# EAGLE design COM644KIT (EAGLE 5.04)
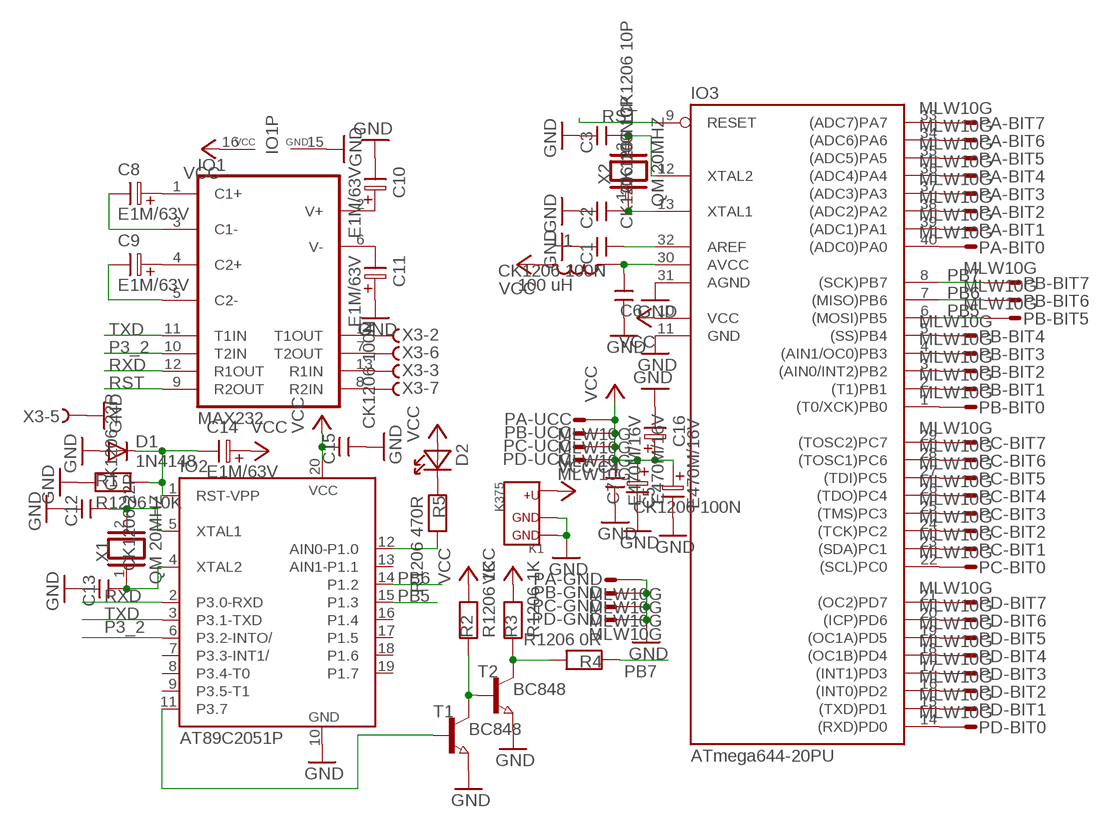
[diagram p0: schematic, sheet 1]

## Parts
C1  CK1206 100N  CK+  [CK+]
C2  CK1206 10P  CK+  [CK+]
C3  CK1206 10P  CK+  [CK+]
C4  CK1206 100N  CK+  [CK+]
C5  E470M/16V  CEL5  [ES-5L]
C6  CK1206 100N  CK+  [CK+]
C7  E470M/16V  CEL5  [ES-5L]
C8  E1M/63V  CEL2,5  [ES-2,5L]
C9  E1M/63V  CEL2,5  [ES-2,5L]
C10  E1M/63V  CEL2,5  [ES-2,5L]
C11  E1M/63V  CEL2,5  [ES-2,5L]
C12  CK1206 22P  CK+  [CK+]
C13  CK1206 22P  CK+  [CK+]
C14  E1M/63V  CEL2,5  [ES-2,5L]
C15  CK1206 100N  CK+  [CK+]
C16  E470M/16V  CEL5  [ES-5L]
D1  1N4148  1N4148DO35-7  [DO35-7]
D2  LED5MM  [LED5]
IO1  MAX232  [DIL16]
IO2  AT89C2051P  [DIL20]
IO3  ATmega644-20PU  MEGA16-P  [DIL40]
K1  K375  K375A  [K375A]
L1  100 uH  L12  [L12]
PA  MLW10G  PSL10MLW10G  [MLW10G]
PB  MLW10G  PSL10MLW10G  [MLW10G]
PC  MLW10G  PSL10MLW10G  [MLW10G]
PD  MLW10G  PSL10MLW10G  [MLW10G]
R1  R1206 10K  RR+  [CK+]
R2  R1206 1K  RR+  [CK+]
R3  R1206 1K  RR+  [CK+]
R4  R1206 0R  RR+  [CK+]
R5  R1206 470R  RR+  [CK+]
T1  BC848  BC848BSOT23  [SOT23]
T2  BC848  BC848BSOT23  [SOT23]
X1  QM 20MHZ  XTAL/S  [QS]
X2  QM 20MHZ  XTAL/S  [QS]
X3  CAN9Z90  [CAN]

## Nets
GND: C1.1 C2.1 C3.1 C4.2 C5.2 C6.1 C7.2 C10.2 C11.1 C12.1 C13.1 C15.2 C16.2 D1.A IO1.15(GND) IO2.10(GND) IO3.11(GND) IO3.31(AGND) K1.1 K1.3 PA.10 PB.10 PC.10 PD.10 R1.1 T1.2(E) T2.2(E) X3.5(-5:F)
N$1: IO3.33((ADC7)PA7) PA.2
N$2: IO3.34((ADC6)PA6) PA.3
N$3: IO3.35((ADC5)PA5) PA.4
N$4: IO3.36((ADC4)PA4) PA.5
N$5: IO3.37((ADC3)PA3) PA.6
N$6: IO3.38((ADC2)PA2) PA.7
N$7: IO3.39((ADC1)PA1) PA.8
N$8: IO3.40((ADC0)PA0) PA.9
N$9: IO2.11(P3.7) T1.1(B)
N$10: R2.1 T1.3(C) T2.1(B)
N$11: R3.1 R4.2 T2.3(C)
N$12: IO3.5((SS)PB4) PB.5
N$13: IO3.4((AIN1/OC0)PB3) PB.6
N$14: IO3.3((AIN0/INT2)PB2) PB.7
N$15: IO3.2((T1)PB1) PB.8
N$16: IO3.1((T0/XCK)PB0) PB.9
N$17: IO3.29((TOSC2)PC7) PC.2
N$18: IO3.28((TOSC1)PC6) PC.3
N$19: IO3.27((TDI)PC5) PC.4
N$20: IO3.26((TDO)PC4) PC.5
N$21: IO3.24((TCK)PC2) PC.7
N$22: IO3.25((TMS)PC3) PC.6
N$23: IO3.23((SDA)PC1) PC.8
N$24: IO3.22((SCL)PC0) PC.9
N$25: IO3.21((OC2)PD7) PD.2
N$26: IO3.20((ICP)PD6) PD.3
N$27: IO3.19((OC1A)PD5) PD.4
N$28: IO3.18((OC1B)PD4) PD.5
N$29: IO3.17((INT1)PD3) PD.6
N$30: IO3.16((INT0)PD2) PD.7
N$31: IO3.15((TXD)PD1) PD.8
N$32: IO3.14((RXD)PD0) PD.9
N$33: C1.2 IO3.32(AREF)
N$34: C3.2 IO3.12(XTAL2) X2.2
N$35: C2.2 IO3.13(XTAL1) X2.1
N$36: C6.2 IO3.30(AVCC) L1.2
N$37: C8.1 IO1.1(C1+)
N$38: C9.1 IO1.4(C2+)
N$39: C10.1 IO1.2(V+)
N$40: C11.2 IO1.6(V-)
N$41: C8.2 IO1.3(C1-)
N$42: C9.2 IO1.5(C2-)
N$43: C12.2 IO2.5(XTAL1) X1.2
N$44: C13.2 IO2.4(XTAL2) X1.1
N$45: C14.2 D1.C IO2.1(RST-VPP) R1.2
N$46: IO1.14(T1OUT) X3.2(-2:F)
N$47: IO1.13(R1IN) X3.3(-3:F)
N$48: IO1.7(T2OUT) X3.6(-6:F)
N$49: IO1.8(R2IN) X3.7(-7:F)
N$50: IO2.12(AIN0-P1.0) R5.2
N$51: D2.2 R5.1
P3_2: IO1.10(T2IN) IO2.6(P3.2-INTO/)
PB5: IO2.15(P1.3) IO3.6((MOSI)PB5) PB.4
PB6: IO2.14(P1.2) IO3.7((MISO)PB6) PB.3
PB7: IO3.8((SCK)PB7) PB.2 R4.1
RST: IO1.9(R2OUT) IO3.9(RESET)
RXD: IO1.12(R1OUT) IO2.2(P3.0-RXD)
TXD: IO1.11(T1IN) IO2.3(P3.1-TXD)
VCC: C4.1 C5.1 C7.1 C14.1 C15.1 C16.1 D2.1 IO1.16(VCC) IO2.20(VCC) IO3.10(VCC) K1.2 L1.1 PA.1 PB.1 PC.1 PD.1 R2.2 R3.2
Unconnected: IO2.7(P3.3-INT1/) IO2.8(P3.4-T0) IO2.9(P3.5-T1) IO2.13(AIN1-P1.1) IO2.16(P1.4) IO2.17(P1.5) IO2.18(P1.6) IO2.19(P1.7) X3.1(-1:F) X3.4(-4:F) X3.8(-8:F) X3.9(-9:F) X3.G1(-G:G1) X3.G2(-G:G2)

## Library data of the parts
C1-C4 C6 C12 C13 C15 = !MOJE:CK+
C5 C7 C16 = !MOJE:CEL5
C8-C11 C14 = !MOJE:CEL2,5
D1 = diode:1N4148: DIODE high speed (Philips)
D2 = !MOJE:LED5MM
IO1 = maxim:MAX232: RS232 TRANSEIVER
IO2 = atmel:AT89C2051: 80C31 MICROCONTROLLER 2 Kbytes FLASH 2.7 V
IO3 = atmel:MEGA16-P: MICROCONTROLLER 16 Kbytes FLASH 1 kbytes SRAM 512 bytes EEPROM USART 8-channel 10 bit ADC Source: avr.lbr
K1 = !MOJE:K375A
L1 = !MOJE:L12
PA PB PC PD = !MOJE:PSL10: CONNECTOR
R1-R5 = !MOJE:RR+
T1 T2 = !MOJE:BC848B: NPN TRANSISTOR
X1 X2 = !MOJE:XTAL/S: CRYSTAL
X3 = !MOJE:CAN9Z90: SUB-D

## Board
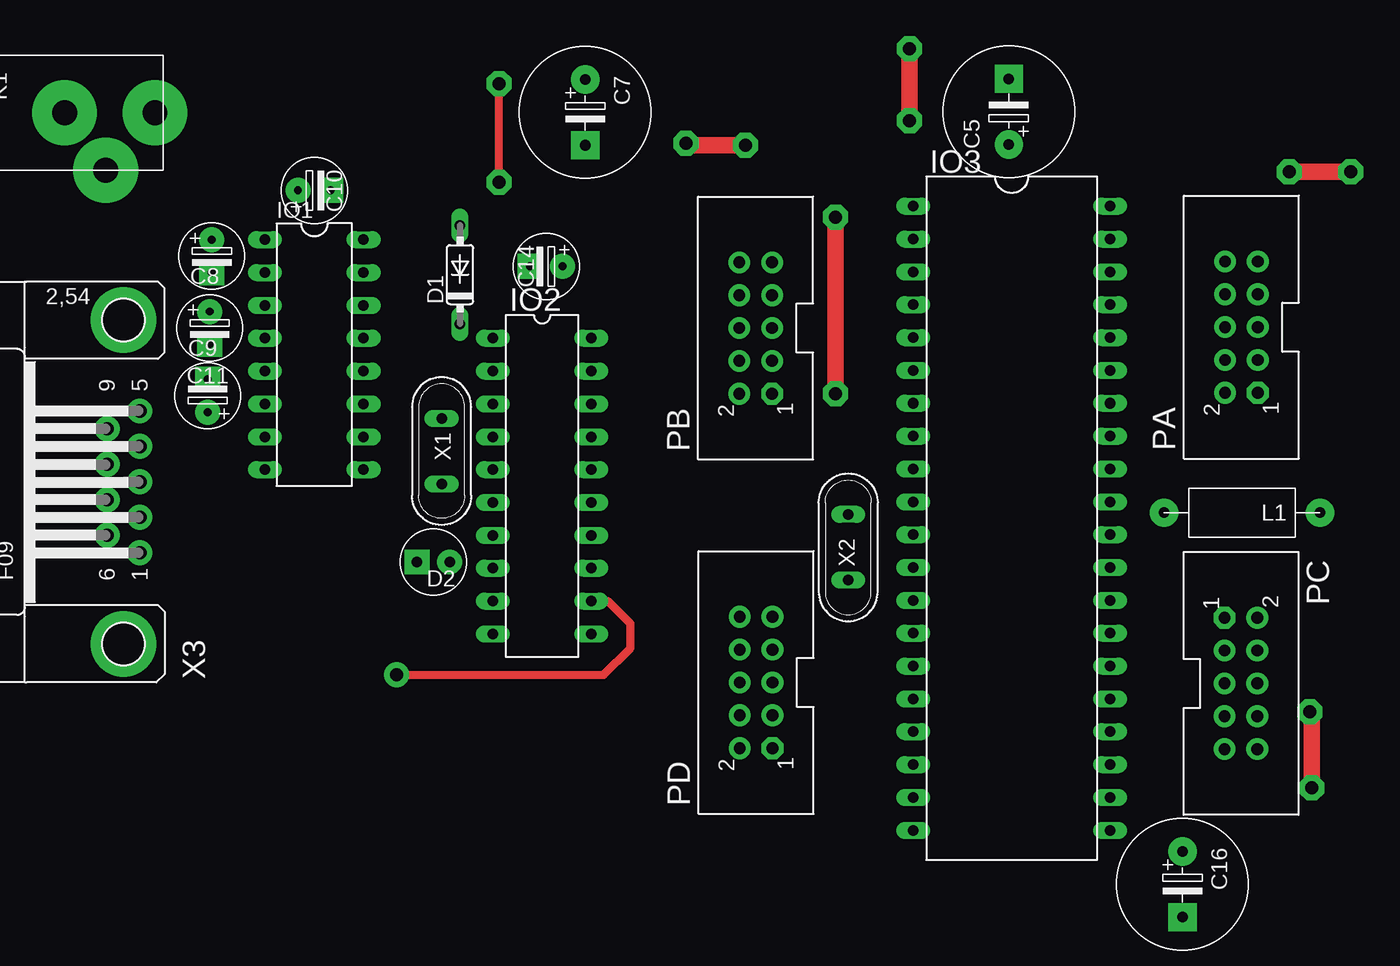
[diagram p1: board, top side]
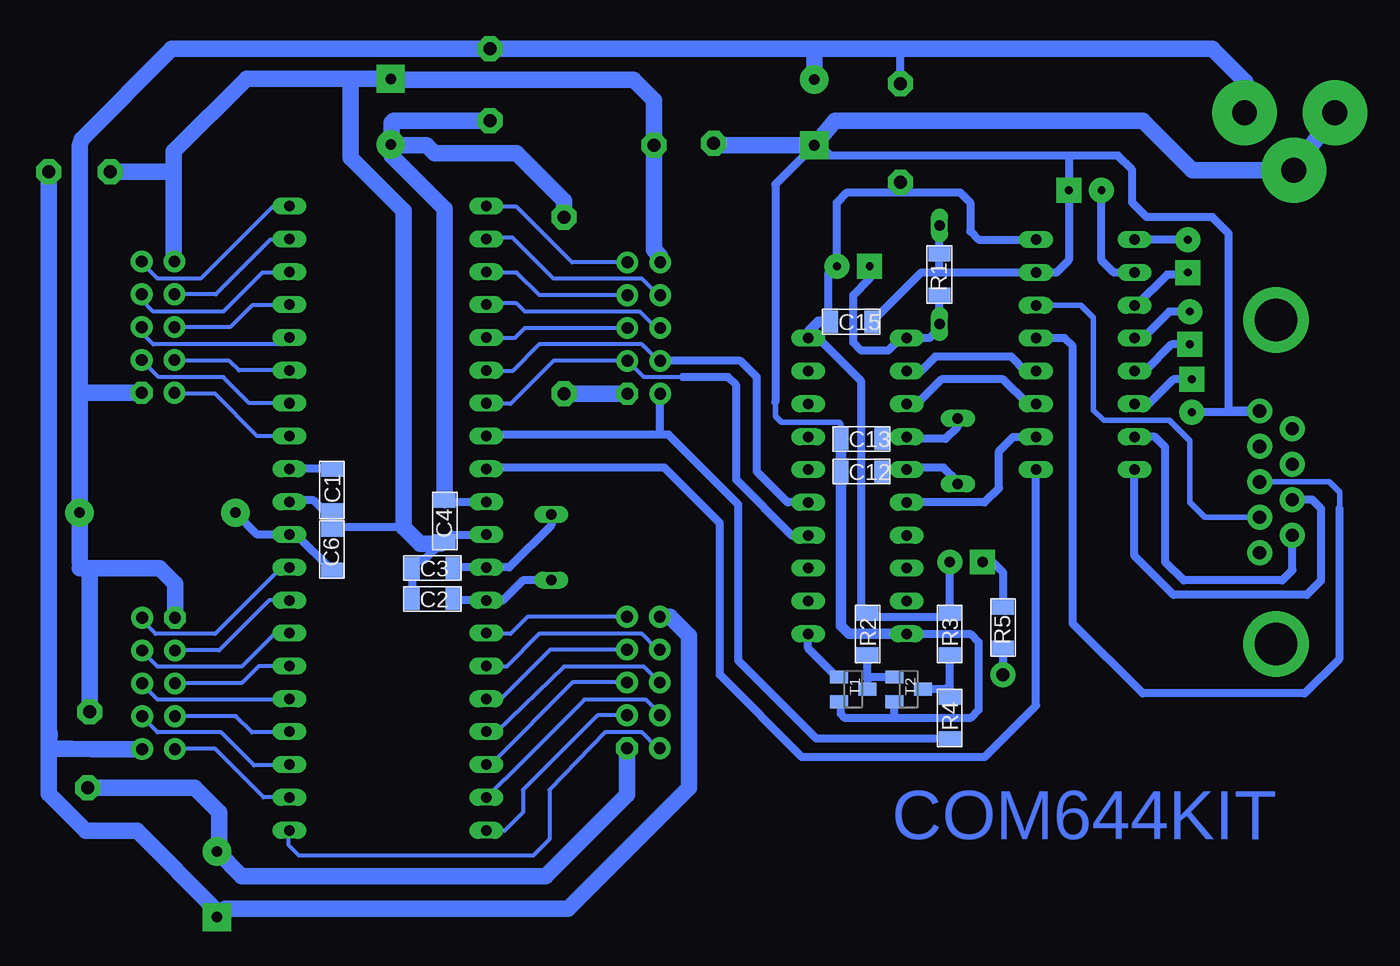
[diagram p2: board, bottom side, seen from below]

No outline drawn. Coordinates in mm, seen from the top.
Copper layers (1*16): Top 0.035mm / dielectric 1.5mm / Bottom 0.035mm
Design rules "default": minimum track width 10mil, minimum drill 24mil, track to track 8mil, track to pad 8mil, pad to pad 8mil, via to via 8mil, smd to smd 8mil, copper to edge 40mil, drill to drill 8mil, minimum pad ring 10mil, minimum via ring 8mil, stop-mask expansion 4mil, vias tented up to drill 0mil, thermal gap 10mil

### Footprints (pad centres in the part's own frame; a part is rotated, then mirrored left to right if it is on the bottom)
CK+ = smd 1.14 x 1.7: 1 -1.587,0; 2 1.587,0
ES-5L = drill 0.813 pad 2.184 round: 1 -2.54,0 | drill 0.813 pad 2.184 square: 2 2.54,0
ES-2,5L = drill 0.61 pad 1.93 round: 1 0,0 | drill 0.61 pad 1.93 square: 2 2.54,0
DO35-7 = drill 0.813 long: A 3.81,0; C -3.81,0
LED5 = drill 0.813 pad 1.93 round: 1 -1.27,0 | drill 0.813 pad 1.93 square: 2 1.27,0
DIL16 = drill 0.813 long: 1 -8.89,-3.81; 2 -6.35,-3.81; 3 -3.81,-3.81; 4 -1.27,-3.81; 5 1.27,-3.81; 6 3.81,-3.81; 7 6.35,-3.81; 8 8.89,-3.81; 9 8.89,3.81; 10 6.35,3.81; 11 3.81,3.81; 12 1.27,3.81; 13 -1.27,3.81; 14 -3.81,3.81; 15 -6.35,3.81; 16 -8.89,3.81
DIL20 = drill 0.813 long: 1 -11.43,-3.81; 2 -8.89,-3.81; 3 -6.35,-3.81; 4 -3.81,-3.81; 5 -1.27,-3.81; 6 1.27,-3.81; 7 3.81,-3.81; 8 6.35,-3.81; 9 8.89,-3.81; 10 11.43,-3.81; 11 11.43,3.81; 12 8.89,3.81; 13 6.35,3.81; 14 3.81,3.81; 15 1.27,3.81; 16 -1.27,3.81; 17 -3.81,3.81; 18 -6.35,3.81; 19 -8.89,3.81; 20 -11.43,3.81
DIL40 = drill 0.813 long: 1 -24.13,-7.62; 2 -21.59,-7.62; 3 -19.05,-7.62; 4 -16.51,-7.62; 5 -13.97,-7.62; 6 -11.43,-7.62; 7 -8.89,-7.62; 8 -6.35,-7.62; 9 -3.81,-7.62; 10 -1.27,-7.62; 11 1.27,-7.62; 12 3.81,-7.62; 13 6.35,-7.62; 14 8.89,-7.62; 15 11.43,-7.62; 16 13.97,-7.62; 17 16.51,-7.62; 18 19.05,-7.62; 19 21.59,-7.62; 20 24.13,-7.62; 21 24.13,7.62; 22 21.59,7.62; 23 19.05,7.62; 24 16.51,7.62; 25 13.97,7.62; 26 11.43,7.62; 27 8.89,7.62; 28 6.35,7.62; 29 3.81,7.62; 30 1.27,7.62; 31 -1.27,7.62; 32 -3.81,7.62; 33 -6.35,7.62; 34 -8.89,7.62; 35 -11.43,7.62; 36 -13.97,7.62; 37 -16.51,7.62; 38 -19.05,7.62; 39 -21.59,7.62; 40 -24.13,7.62
K375A = drill 1.93 pad 5 round: 1 4.445,6.985; 2 4.445,13.97; 3 8.89,10.16
L12 = drill 0.813 pad 2.184 round: 1 0,0; 2 12.065,0
MLW10G = drill 0.914 pad 1.676 octagon: 1 -5.08,-1.27 | drill 0.914 pad 1.676 round: 2 -5.08,1.27; 3 -2.54,-1.27; 4 -2.54,1.27; 5 0,-1.27; 6 0,1.27; 7 2.54,-1.27; 8 2.54,1.27; 9 5.08,-1.27; 10 5.08,1.27
SOT23 = smd 1 x 1.4: 1 -0.95,-1.1; 2 0.95,-1.1; 3 0,1.1
QS = drill 0.813 long: 1 -2.54,0; 2 2.54,0
CAN = drill 1.016 pad 1.93 round: 1 -5.486,-1.27; 2 -2.743,-1.27; 3 0,-1.27; 4 2.743,-1.27; 5 5.486,-1.27; 6 -4.115,1.27; 7 -1.372,1.27; 8 1.372,1.27; 9 4.115,1.27 | drill 3.302 pad 5.08 round: G1 -12.522,0; G2 12.522,0

### Placement (x,y rotation side)
C1  81.6,34.13 90 bottom
C2  73.82,25.72 0 bottom
C3  73.82,28.1 0 bottom
C4  72.87,31.75 270 bottom
C5  77.06,63.39 90 top
C6  81.6,29.53 270 bottom
C7  44.29,63.34 270 top
C8  15.4,53.5 270 top
C9  15.24,47.94 270 top
C10  22.07,57.31 0 top
C11  15.08,40.16 90 top
C12  40.64,35.56 0 bottom
C13  40.64,38.1 0 bottom
C14  42.55,51.43 180 top
C15  41.43,47.15 0 bottom
C16  90.49,3.65 270 top
D1  34.61,50.8 90 top
D2  32.54,28.57 180 top
IO1  23.34,44.61 270 top
IO2  40.96,34.45 270 top
IO3  77.27,31.96 270 top
K1  -2.97,67.76 270 top
L1  101.12,32.38 180 top
PA  95.05,46.74 90 top
PB  57.47,46.66 90 top
PC  95.01,19.19 270 top
PD  57.51,19.26 90 top
R1  34.61,50.8 270 bottom
R2  40.16,23.02 90 bottom
R3  33.81,23.02 90 bottom
R4  33.81,16.51 90 bottom
R5  29.69,23.5 270 bottom
T1  41.27,18.73 270 bottom
T2  36.99,18.73 270 bottom
X1  33.18,37.15 270 top
X2  64.63,29.71 90 top
X3  8.57,34.77 90 top

### Tracks (layer width: path | path; a pad name or v marks a point on that pad's centre or on a via)
GND  (via drill 1 pad 1.93)
  Top 1.27: v56.67,60.8 52.23,60.8 v52.07,60.96 | v98.74,58.74 v103.5,58.74
  Bottom 0.406: C13.1 42.23,39.21 42.39,39.37 46.83,39.37 47.31,39.85 47.31,40.96
  Bottom 0.61: IO3.11 72.34,30.69 C4.2 73.03,30 73.18,30 74.45,28.73 74.77,28.73 C3.1 | C3.1 C2.1 | C3.1 | 76.04,31.27 80.96,31.27 | 80.96,31.27 81.52,31.83 | 81.52,31.83 83.03,33.34 84.79,33.34 IO3.31 | C11.1 9.93,40.16 X3.5 11.99,40.25 12.06,40.32 12.22,40.16 12.22,53.82 12.22,53.98 13.49,55.24 18.57,55.24 19.68,56.36 19.68,58.9 20.8,60.01 | R1.1 D1.A | 34.45,50.96 IO1.15 25.56,50.96 24.61,51.91 C10.2 24.61,60.01 23.5,60.01 20.8,60.01 | 34.45,50.96 34.61,50.96 R1.1 | R1.1 34.61,51.12 34.45,50.96 | 34.45,50.96 36.04,50.96 C15.2 | C1.1 81.6,31.91 81.52,31.83 | 80.96,31.27 81.44,31.27 C6.1 | 20.8,60.01 43.02,60.01 44.13,61.12 44.29,61.12 C7.2 47.31,57.78 47.31,40.96 | 42.23,17.78 T1.2 42.23,17.64 42.23,16.83 41.91,16.51 38.1,16.51 38.09,16.52 | 38.09,16.52 T2.2 | 41.59,23.02 32.23,23.02 31.59,22.38 31.59,17.14 32.23,16.51 38.08,16.51 38.09,16.52
  Bottom 0.813: C13.1 C12.1 | C12.1 | C12.1 42.23,23.65 41.59,23.02 IO2.10 | IO2.10
  Bottom 1.27: 80.17,65.94 C5.2 77,65.88 58.26,65.88 56.67,64.29 v56.67,60.8 56.67,52.7 56.2,52.23 PB.10 | 80.17,65.94 88.21,65.94 93.82,60.33 | 93.82,60.33 | 93.82,60.33 93.82,59.05 | 93.82,59.05 93.82,51.86 PA.10 | 73.18,30 74.77,30 76.04,31.27 76.04,55.72 80.17,59.85 80.17,65.94 | PC.10 100.15,14.11 101.76,14.13 103.5,14.13 | 103.42,15.32 103.5,15.56 v103.5,58.74 | 103.42,15.32 103.5,14.13 | v98.74,58.74 94.14,58.74 93.82,59.05 | v52.07,60.96 51.91,60.8 C7.2 42.7,62.71 18.89,62.71 15.05,58.87 K1.3 4.34,62.84 K1.1 | PD.10 55.45,24.34 53.98,22.86 53.98,11.11 63.34,1.75 89.85,1.75 C16.2 90.49,1.59 96.68,7.78 100.65,7.78 103.5,10.64 103.5,14.13 | 103.5,14.13 103.5,15.4 103.42,15.32
N$1
  Bottom 0.305: IO3.33 87.36,38.31 90.65,41.59 93.71,41.59 PA.2
N$2
  Bottom 0.305: IO3.34 88,40.85 90.01,42.86 94.98,42.86 PA.3
N$3
  Bottom 0.305: IO3.35 88.79,43.39 89.53,44.13 93.71,44.13 PA.4
N$4
  Bottom 0.305: PA.5 96.32,46.31 95.41,45.4 85.42,45.4 IO3.36
N$5
  Bottom 0.305: PA.6 89.47,46.74 87.79,48.42 84.95,48.42 IO3.37
N$6
  Bottom 0.305: PA.7 96.32,48.85 95.41,47.94 90.01,47.94 87,50.96 84.95,50.96 IO3.38
N$7
  Bottom 0.305: PA.8 90.58,49.28 86.36,53.5 84.95,53.5 IO3.39
N$8
  Bottom 0.305: PA.9 96.32,51.71 95.09,50.48 91.76,50.48 86.2,56.04 84.95,56.04 IO3.40
N$9
  Bottom 0.61: T1.1 42.54,19.68 44.77,21.91 IO2.11
N$10
  Bottom 0.61: 40.17,19.53 T1.3 | 40.17,19.53 40.17,21.42 R2.1 | T2.1 40.02,19.68 40.17,19.53
N$11
  Bottom 0.61: 33.81,19.05 R4.2 | 33.81,19.05 R3.1 | T2.3 34.13,18.73 33.81,19.05
N$12
  Bottom 0.305: PB.5 66.68,46.66 67.47,45.88 69.6,45.88 IO3.5
N$13
  Bottom 0.305: PB.6 56.51,46.66 57.78,47.94 66.67,47.94 67.31,48.58 69.55,48.58 IO3.4
N$14
  Bottom 0.305: PB.7 65.56,49.2 67.31,50.96 69.6,50.96 IO3.3
N$15
  Bottom 0.305: PB.8 56.35,49.2 57.63,50.48 64.45,50.48 67.63,53.66 69.55,53.66 IO3.2
N$16
  Bottom 0.305: PB.9 63.02,51.74 67.31,56.04 69.6,56.04 IO3.1
N$17
  Bottom 0.305: PC.2 96.28,24.05 95.25,23.02 90.65,23.02 85.57,28.1 84.95,28.1 IO3.29
N$18
  Bottom 0.305: IO3.28 86.47,25.61 90.33,21.75 93.72,21.75 PC.3
N$19
  Bottom 0.305: PC.4 96.28,21.67 95.09,20.48 88.58,20.48 86.04,23.02 84.95,23.02 IO3.27
N$20
  Bottom 0.305: IO3.26 87.26,20.53 88.58,19.21 93.72,19.21 PC.5
N$21
  Bottom 0.305: PC.7 89.04,16.65 87.79,15.4 84.95,15.4 IO3.24
N$22
  Bottom 0.305: PC.6 96.28,19.13 95.09,17.94 84.95,17.94 IO3.25
N$23
  Bottom 0.305: PC.8 96.28,16.59 95.09,15.4 90.17,15.4 87.63,12.86 84.95,12.86 IO3.23
N$24
  Bottom 0.305: IO3.22 86.89,10.37 90.65,14.13 93.72,14.13 PC.9
N$25
  Bottom 0.305: PD.2 56.41,14.18 57.63,15.4 60.48,15.4 64.77,10.95 64.77,7.14 66.04,5.87 66.36,5.87 84.14,5.87 84.93,6.67 IO3.21
N$26
  Bottom 0.305: PD.3 61.07,16.72 66.83,10.95 66.83,9.21 68.26,7.78 69.6,7.78 IO3.20
N$27
  Bottom 0.305: PD.4 56.24,16.87 57.31,17.94 62.07,17.94 68.26,11.75 68.28,11.75 IO3.19
N$28
  Bottom 0.305: PD.5 62.97,19.26 69.22,13.02 69.55,13.02 IO3.18
N$29
  Bottom 0.305: PD.6 57.47,20.48 63.66,20.48 68.9,15.4 69.6,15.4 IO3.17
N$30
  Bottom 0.305: PD.7 64.72,21.8 68.58,17.94 69.6,17.94 IO3.16
N$31
  Bottom 0.305: PD.8 56.41,21.8 57.63,23.02 65.56,23.02 68.1,20.48 69.6,20.48 IO3.15
N$32
  Bottom 0.305: PD.9 66.47,24.34 67.79,23.02 69.6,23.02 IO3.14
N$33
  Bottom 0.61: IO3.32 81.65,35.77 C1.2
N$34
  Bottom 0.61: C3.2 72.18,28.15 IO3.12 67.89,28.15 64.61,31.43 64.61,32.23 X2.2
N$35
  Bottom 0.61: X2.1 64.65,27.15 66.83,27.15 68.37,25.61 IO3.13 72.12,25.61 C2.2
N$36
  Bottom 0.61: L1.2 | C6.2 84.35,30.69 IO3.30 87.36,30.69 L1.2
N$37
  Bottom 0.61: C8.1 IO1.1 | IO1.1
N$38
  Bottom 0.61: IO1.4 18.89,45.88 16.83,47.94 C9.1 | C9.1
N$39
  Bottom 0.61: IO1.2 21.11,50.96 22.07,51.91 C10.1
N$40
  Bottom 0.61: IO1.6 18.41,40.8 16.51,42.7 C11.2
N$41
  Bottom 0.61: IO1.3 19.37,48.42 16.99,50.8 15.56,50.8 C8.2
N$42
  Bottom 0.61: IO1.5 18.73,43.34 16.67,45.4 C9.2 | C9.2
N$43
  Bottom 0.61: X1.2 33.18,34.77 34.29,35.88 36.99,35.88 IO2.5 38.89,35.72 C12.2
N$44
  Bottom 0.61: X1.1 33.18,39.05 34.13,38.1 36.99,38.1 IO2.4 38.89,38.26 C13.2
N$45
  Bottom 0.61: R1.2 D1.C 34.61,46.67 35.4,45.88 IO2.1 37.31,45.72 37.78,45.72 38.58,44.93 40.64,44.93 41.27,45.56 41.27,49.21 40.01,50.48 C14.2
N$46
  Bottom 0.406: X3.2 14.08,32.02 15.24,33.18 15.24,37.94 16.83,39.53 21.91,39.53 22.7,40.32 22.7,47.47 23.65,48.42 IO1.14
N$47
  Bottom 0.406: X3.3 4.45,34.77 3.65,33.97 3.65,32.7
  Bottom 0.61: 3.65,32.7 3.65,21.11 6.35,18.41 18.89,18.41 24.29,23.81 24.29,45.24 24.92,45.88 IO1.13
N$48
  Bottom 0.61: X3.6 7.3,27.94 8.1,27.15 15.72,27.15 17.14,28.57 17.14,37.47 17.94,38.26 IO1.7
N$49
  Bottom 0.61: X3.7 5.77,33.4 5.08,32.7 5.08,27.15 6.19,26.04 16.51,26.04 19.53,29.05 IO1.8
N$50  (via drill 1 pad 1.93)
  Top 0.61: v29.69,19.84 45.72,19.84 47.78,21.91 47.78,23.81 46.04,25.56 IO2.12
  Bottom 0.61: R5.2 v29.69,19.84 | v29.69,19.84
N$51
  Bottom 0.61: D2.2 30.48,28.57 29.69,27.78 R5.1 | R5.1
P3_2
  Bottom 0.61: IO2.6 31.11,33.18 30,34.29 30,37.15 28.89,38.26 IO1.10
PB5
  Bottom 0.305: PB.4 56.35,44.12 57.47,45.24 | 57.47,45.24 | 57.47,45.24 57.63,45.4 65.56,45.4 67.63,43.34 69.6,43.34 IO3.6
  Bottom 0.61: IO2.15 46.35,33.18 48.74,35.56 48.74,42.86 50.01,44.13 56.2,44.13 PB.4
PB6
  Bottom 0.305: IO3.7 69.6,40.8 67.79,40.8 64.46,44.12 PB.3 57.47,42.86 54.45,42.86
  Bottom 0.61: IO2.14 46.04,30.64 50.32,34.92 50.32,42.23 50.96,42.86 54.45,42.86
PB7
  Bottom 0.61: R4.1 44.13,14.92 50.16,20.95 50.16,33.02 55.56,38.42 56.2,38.42 | 56.2,38.42 68.28,38.42 IO3.8 | PB.2 56.2,38.42
RST
  Bottom 0.61: IO1.9 27.15,17.46 31.11,13.49 45.24,13.49 51.59,19.84 51.59,31.59 55.88,35.88 69.55,35.88 IO3.9
RXD
  Bottom 0.61: IO1.12 27.94,43.34 29.05,44.45 34.92,44.45 36.04,43.34 IO2.2
TXD
  Bottom 0.61: IO2.3 36.35,40.8 34.45,42.7 29.69,42.7 27.78,40.8 IO1.11
VCC  (via drill 1 pad 1.93)
  Top 0.61: v37.62,57.94 37.62,65.41 v37.62,65.56
  Top 1.27: v69.37,68.26 v69.37,62.71 | v63.66,55.24 v63.66,41.59 | v100.49,11.11 100.49,16.83 v100.33,16.99
  Bottom 0.61: IO3.10 72.76,33.23 C4.1 | C14.1 42.7,51.44 43.02,51.12 | 43.02,51.12 43.18,50.96 43.18,47.31 C15.1 | IO1.16 31.59,53.5 32.23,54.13 32.23,56.36 33.02,57.15 37.62,57.15 | 43.02,51.12 42.55,51.59 42.55,56.36 41.75,57.15 37.62,57.15 | 37.62,57.15 v37.62,57.94 | v37.62,65.56 37.62,68.1 37.78,68.26 | IO2.20 43.97,45.88 40.64,42.55 40.64,24.92 40.16,24.45 R2.2 39.85,24.29 33.97,24.29 33.81,24.45 R3.2 D2.1 | IO2.20
  Bottom 0.813: C15.1 43.97,47.15 44.61,46.51 44.61,46.04 IO2.20
  Bottom 1.27: C4.1 72.87,55.88 76.99,60.01 76.99,60.79 C5.1 | 101.12,41.91 L1.1 | 101.12,41.91 101.12,60.8 100.97,61.28 93.98,68.26 v69.37,68.26 44.13,68.26 | PC.1 93.74,26.91 94.93,28.1 100.65,28.1 | 101.12,28.1 100.65,28.1 | 101.12,28.1 101.04,28.34 101.12,28.57 L1.1 | L1.1 | 101.12,28.1 | PA.1 100.87,41.66 101.12,41.91 | C7.1 44.29,68.1 44.13,68.26 | 44.13,68.26 37.78,68.26 13.49,68.26 10.95,65.72 K1.2 | PB.1 v63.65,41.59 v63.66,41.59 | v63.66,55.24 63.66,56.52 66.2,59.05 | v69.37,62.71 76.83,62.71 76.99,62.55 76.99,60.92 C5.1 | 66.2,59.05 | 66.2,59.05 67.31,60.17 73.66,60.17 74.3,60.8 77,60.8 C5.1 | v100.33,16.99 100.33,27.78 100.65,28.1 | v100.49,11.11 92.23,11.11 90.33,9.21 90.33,6.35 C16.1 88.58,4.29 65.09,4.29 58.78,10.6 PD.1

### Text on the board
Bottom: COM644KIT
nofill: 5V | PA | PB | IND | PC | PD | COM